# Altium schematic sheet ZigBee.SchDoc
size A4
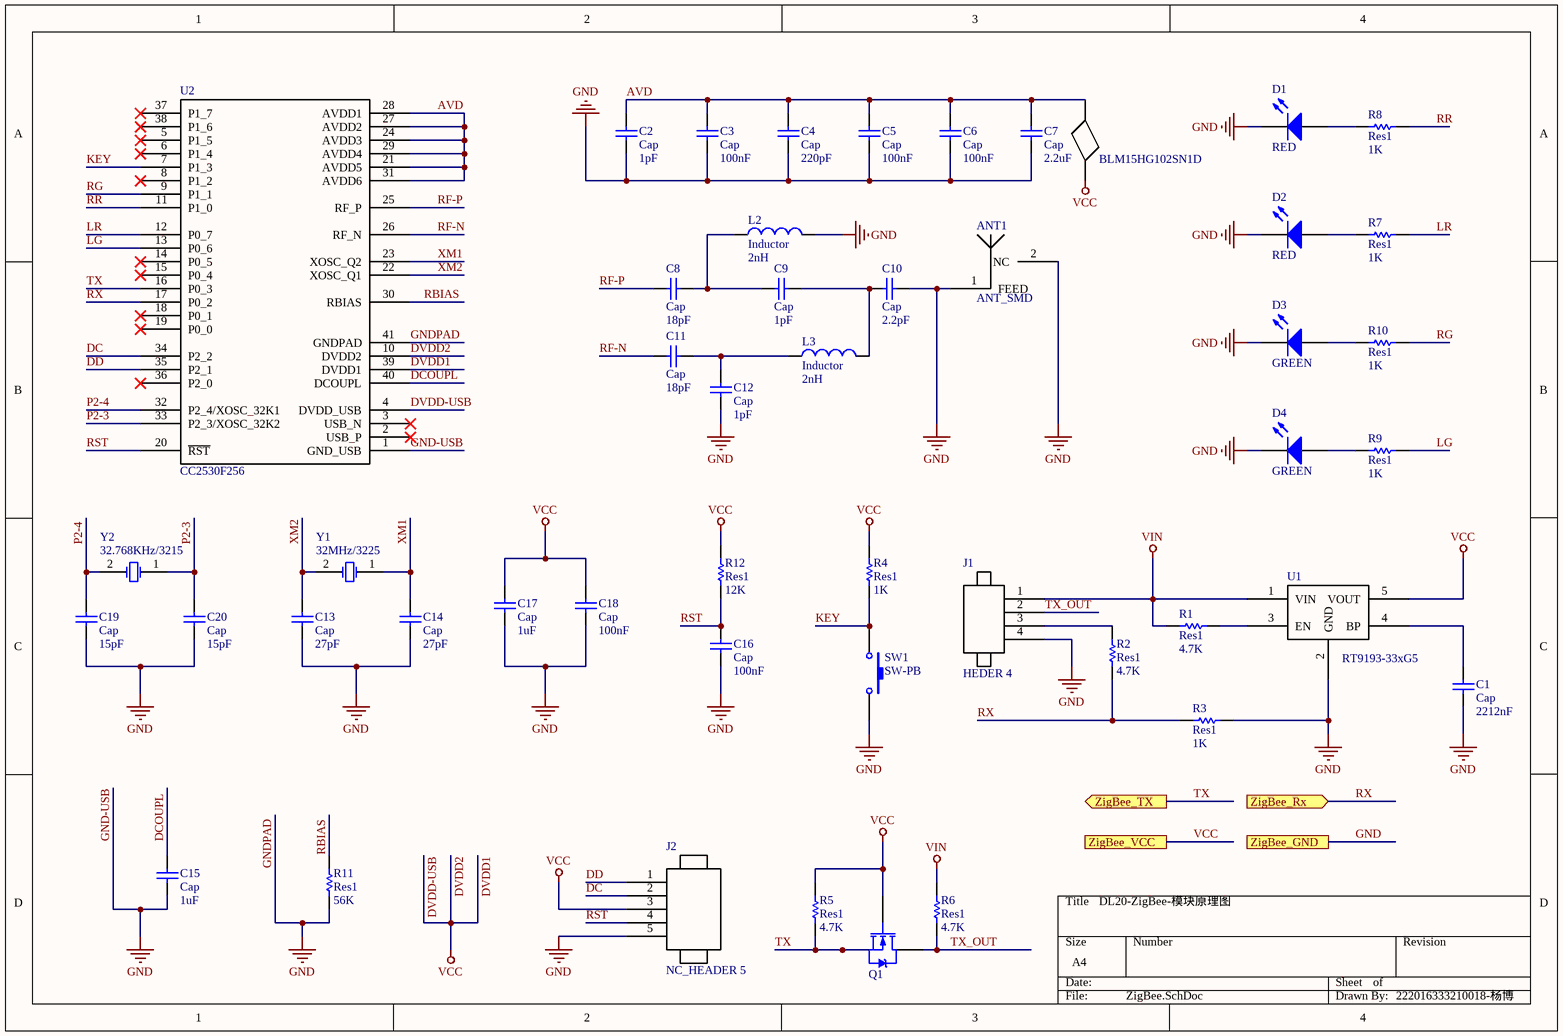
[diagram p0: ZigBee.SchDoc]

## Parts
ANT1  ANT_SMD
BLM  BLM15HG102SN1D
C1  Cap  value 2212nF  [RAD-0.3]
C2  Cap  value 1pF  [RAD-0.3]
C3  Cap  value 100nF  [RAD-0.3]
C4  Cap  value 220pF  [RAD-0.3]
C5  Cap  value 100nF  [RAD-0.3]
C6  Cap  value 100nF  [RAD-0.3]
C7  Cap  value 2.2uF  [RAD-0.3]
C8  Cap  value 18pF  [RAD-0.3]
C9  Cap  value 1pF  [RAD-0.3]
C10  Cap  value 2.2pF  [RAD-0.3]
C11  Cap  value 18pF  [RAD-0.3]
C12  Cap  value 1pF  [RAD-0.3]
C13  Cap  value 27pF  [RAD-0.3]
C14  Cap  value 27pF  [RAD-0.3]
C15  Cap  value 1uF  [RAD-0.3]
C16  Cap  value 100nF  [RAD-0.3]
C17  Cap  value 1uF  [RAD-0.3]
C18  Cap  value 100nF  [RAD-0.3]
C19  Cap  value 15pF  [RAD-0.3]
C20  Cap  value 15pF  [RAD-0.3]
D1  RED  [LED-0]
D2  RED  [LED-0]
D3  GREEN  [LED-0]
D4  GREEN  [LED-0]
J1  HEDER 4
J2  NC_HEADER 5
L2  Inductor  value 2nH  [0402-A]
L3  Inductor  value 2nH  [0402-A]
Q1  NMOS-2  [TO-220AB]  (value not drawn)
R1  Res1  value 4.7K  [AXIAL-0.3]
R2  Res1  value 4.7K  [AXIAL-0.3]
R3  Res1  value 1K  [AXIAL-0.3]
R4  Res1  value 1K  [AXIAL-0.3]
R5  Res1  value 4.7K  [AXIAL-0.3]
R6  Res1  value 4.7K  [AXIAL-0.3]
R7  Res1  value 1K  [AXIAL-0.3]
R8  Res1  value 1K  [AXIAL-0.3]
R9  Res1  value 1K  [AXIAL-0.3]
R10  Res1  value 1K  [AXIAL-0.3]
R11  Res1  value 56K  [AXIAL-0.3]
R12  Res1  value 12K  [AXIAL-0.3]
SW1  SW-PB  [SPST-2]
U1  RT9193-33xG5
U2  CC2530F256
Y1  32MHz/3225  [R38]
Y2  32.768KHz/3215  [R38]

## Ports
ZigBee_GND, ZigBee_Rx (in), ZigBee_TX (out), ZigBee_VCC

## Nets
DVDD-USB: BLM.7 C17.2 C18.2 J2.3 Q1.1(G) R4.2 R5.2 R12.2 U1.5(VOUT) U2.4(DVDD_USB) U2.10(DVDD2) U2.39(DVDD1) ; port ZigBee_VCC  [also labelled DVDD1, DVDD2, VCC]
GND: ANT1.1(FEED) ANT1.2(NC) C1.1 C2.1 C3.1 C4.1 C5.1 C6.1 C7.1 C10.2 C12.2 C13.1 C14.1 C15.1 C16.1 C17.1 C18.1 C19.1 C20.1 D1.2(K) D2.2(K) D3.2(K) D4.2(K) J1.4 J2.5 L2.2 R3.1 R11.1 SW1.2 U1.2(GND) U2.1(GND_USB) U2.41(GNDPAD) ; port ZigBee_GND  [also labelled GND-USB, GNDPAD]
VIN: J1.1 R1.2 R6.2 U1.1(VIN)
\: Q1.3(S) R5.1 R10.1 U2.9(P1_1) U2.16(P0_3) ; port ZigBee_TX  [also labelled RG, TX]
AVD: BLM.6 C2.2 C3.2 C4.2 C5.2 C6.2 C7.2 U2.21(AVDD5) U2.24(AVDD3) U2.27(AVDD2) U2.28(AVDD1) U2.29(AVDD4) U2.31(AVDD6)
DC: J2.2 U2.34(P2_2)
DCOUPL: C15.2 U2.40(DCOUPL)
DD: J2.1 U2.35(P2_1)
KEY: R4.1 SW1.1 U2.7(P1_3)
LG: R9.1 U2.13(P0_6)
LR: R7.1 U2.12(P0_7)
P2-3: C20.2 U2.33(P2_3/XOSC_32K2) Y2.1(OSC1)
P2-4: C19.2 U2.32(P2_4/XOSC_32K1) Y2.2(OSC2)
RBIAS: R11.2 U2.30(RBIAS)
RF-N: C11.1 U2.26(RF_N)
RF-P: C8.1 U2.25(RF_P)
RR: R8.1 U2.11(P1_0)
RST: C16.2 J2.4 R12.1 U2.20(~{RST})
RX: R2.1 R3.2 U2.17(P0_2) ; port ZigBee_Rx
TX_OUT: J1.2 Q1.2(D) R6.1
XM1: C14.2 U2.23(XOSC_Q2) Y1.1(OSC1)
XM2: C13.2 U2.22(XOSC_Q1) Y1.2(OSC2)
NetC1_2: C1.2 U1.4(BP)
NetC8_2: C8.2 C9.1 L2.1
NetC9_2: C9.2 C10.1 L3.2
NetC11_2: C11.2 C12.1 L3.1
NetD1_1: D1.1(A) R8.2
NetD2_1: D2.1(A) R7.2
NetD3_1: D3.1(A) R10.2
NetD4_1: D4.1(A) R9.2
NetJ1_3: J1.3 R2.2
NetR1_1: R1.1 U1.3(EN)

Not connected (* = marked no-connect by the designer): U2 2(USB_P)* 3(USB_N)* 5(P1_5)* 6(P1_4)* 8(P1_2)* 14(P0_5)* 15(P0_4)* 18(P0_1)* 19(P0_0)* 36(P2_0)* 37(P1_7)* 38(P1_6)*

## Notes on the sheet
- DL20-ZigBee-模块原理图
- 222016333210018-杨博

## Library data of the parts
C1-C20 = Cap: Capacitor; Published: 8-Jun-2000; LatestRevisionDate: 17-Jul-2002; LatestRevisionNote: Re-released for DXP Platform.; PackageReference: RAD-0.3; Publisher: Altium Limited; PackageDescription: Radial Cap, Thru-Hole; 2 Leads; 0.3 in Pin Spacing
D1-D4 = LED0: Typical INFRARED GaAs LED; Published: 8-Jun-2000; LatestRevisionDate: 08-Jul-2005; LatestRevisionNote: Mech Layer 1 removed.; PackageReference: LED-0; Publisher: Altium Limited; PackageDescription: LED; 2 Leads
L2 L3 = Inductor: Code_IEC: 1005; Published: 8-Jun-2000; LatestRevisionDate: 29-May-2009; LatestRevisionNote: IPC-7351 Footprint Added.; PackageReference: 0402-A; Publisher: Altium Limited; PackageDescription: Chip Inductor; Code_JEITA: 0402
Q1 = NMOS-2: N-Channel Power MOSFET; Note: Pin 2 is electrically connected to pin 4.; Published: 8-Jun-2000; LatestRevisionDate: 17-Jul-2002; LatestRevisionNote: Re-released for DXP Platform.; DatasheetVersion: PD-9.814; PackageVersion: Feb-1997; PackageReference: TO-220AB; Publisher: Altium Limited; PackageDescription: TO, Thru-Hole, Vertical, Heatsink Mounted; 3 In-Line Leads; Pitch 2.54 mm; ComponentLink1Description: Manufacturer Link; ComponentLink1URL: http://www.irf.com/
R1-R12 = Res1: Resistor; Published: 8-Jun-2000; LatestRevisionDate: 17-Jul-2002; LatestRevisionNote: Re-released for DXP Platform.; PackageReference: AXIAL-0.3; Publisher: Altium Limited; PackageDescription: Axial Device, Thru-Hole; 2 Leads; 0.3 in Pin Spacing
SW1 = SW-PB: Switch; Published: 24-Mar-1999; LatestRevisionDate: 17-Jul-2002; LatestRevisionNote: Re-released for DXP Platform.; PackageReference: SPST-2; Publisher: Altium Limited; PackageDescription: Switch; 2 Leads
Y1 Y2 = XTAL: Crystal Oscillator; Published: 8-Jun-2000; LatestRevisionDate: 17-Jul-2002; LatestRevisionNote: Re-released for DXP Platform.; PackageReference: R38; Publisher: Altium Limited; PackageDescription: Crystal, Thru-Hole; 2 Leads; Body 3.1 x 8.2 mm (Dia.xH)